# EAGLE design Alarm Controller v3 (EAGLE 7.3.0)
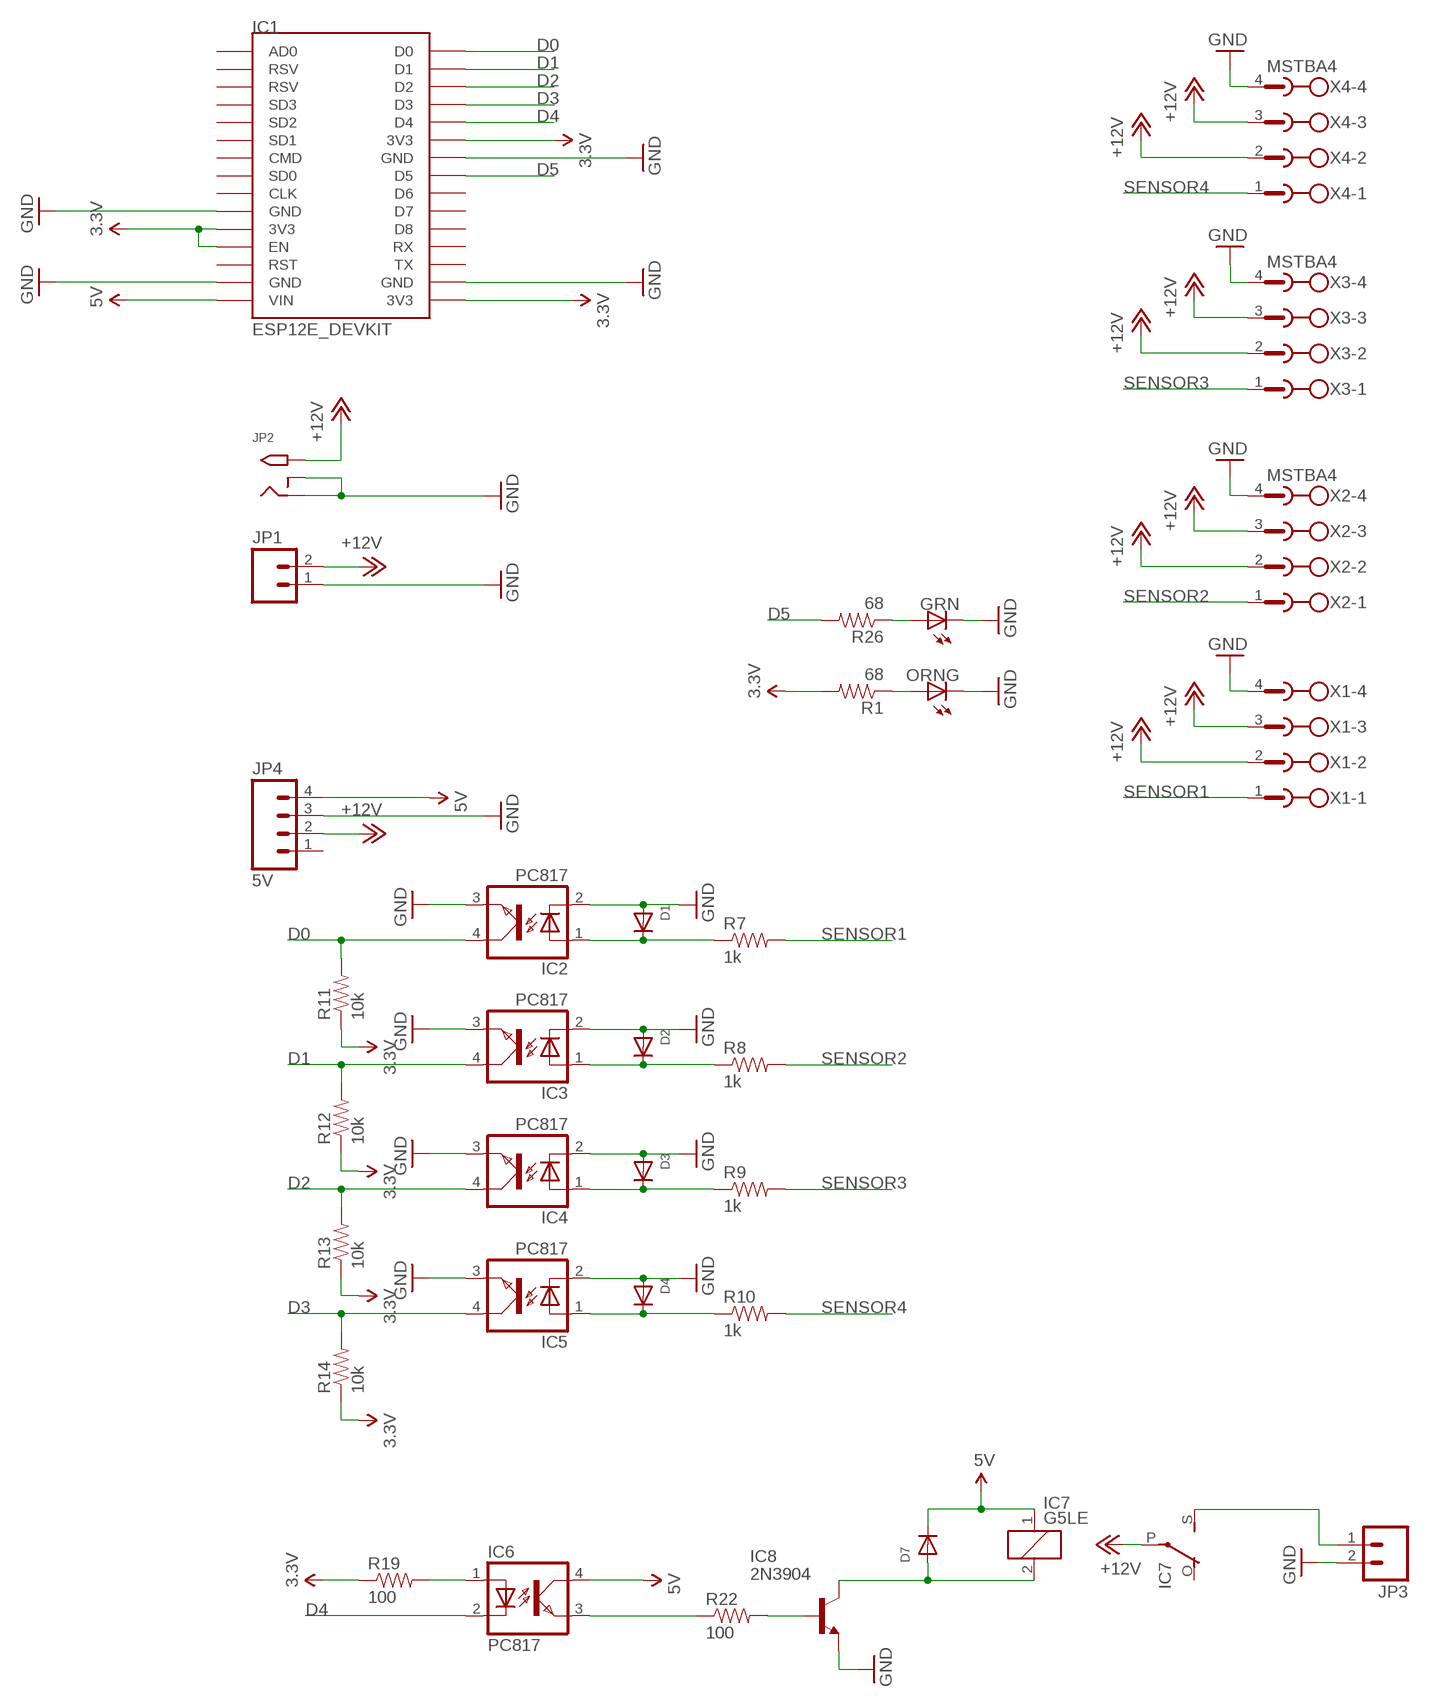
[diagram p0: schematic, sheet 1]

## Parts
D1  RB751S-40TE61CT-ND  DIODESOD-523  [SOD-523]
D2  RB751S-40TE61CT-ND  DIODESOD-523  [SOD-523]
D3  RB751S-40TE61CT-ND  DIODESOD-523  [SOD-523]
D4  RB751S-40TE61CT-ND  DIODESOD-523  [SOD-523]
D7  RB751S-40TE61CT-ND  DIODESOD-523  [SOD-523]
IC1  ESP12E_DEVKIT  [ESP12E_DEVKIT]
IC2  PC817  [DIL04]
IC3  PC817  [DIL04]
IC4  PC817  [DIL04]
IC5  PC817  [DIL04]
IC6  PC817  [DIL04]
IC7  G5LE  [G5LE]
IC8  2N3904  [TO92]
JP1  M023.5MM_LOCK  [SCREWTERMINAL-3.5MM-2_LOCK]
JP2  2.1MMJACKTHM  [PJ-102A]
JP3  M023.5MM_LOCK  [SCREWTERMINAL-3.5MM-2_LOCK]
JP4  5V  M04LOCK_LONGPADS  [1X04_LOCK_LONGPADS]
LED  GRN  LEDSML0805  [SML0805]
LED2  ORNG  LEDSML0805  [SML0805]
R1  68  RESISTOR0603-RES  [0603-RES]
R7  1k  RESISTOR0603-RES  [0603-RES]
R8  1k  RESISTOR0603-RES  [0603-RES]
R9  1k  RESISTOR0603-RES  [0603-RES]
R10  1k  RESISTOR0603-RES  [0603-RES]
R11  10k  RESISTOR0603-RES  [0603-RES]
R12  10k  RESISTOR0603-RES  [0603-RES]
R13  10k  RESISTOR0603-RES  [0603-RES]
R14  10k  RESISTOR0603-RES  [0603-RES]
R19  100  RESISTOR0603-RES  [0603-RES]
R22  100  RESISTOR0603-RES  [0603-RES]
R26  68  RESISTOR0603-RES  [0603-RES]
X1  MSTBA4  [MSTBA4]
X2  MSTBA4  [MSTBA4]
X3  MSTBA4  [MSTBA4]
X4  MSTBA4  [MSTBA4]

## Nets
3.3V: IC1.3V3@0(3V3) IC1.3V3@1(3V3) IC1.3V3@2(3V3) IC1.EN R1.2 R11.1 R12.1 R13.1 R14.1 R19.1
5V: D7.K(C) IC1.VIN IC6.4(COL) IC7.1 JP4.4
+12V: IC7.P(2:P) JP1.2 JP2.TIP JP4.2 X1.2 X1.3 X2.2 X2.3 X3.2 X3.3 X4.2 X4.3
D0: IC1.D0 IC2.4(COL) R11.2
D1: IC1.D1 IC3.4(COL) R12.2
D2: IC1.D2 IC4.4(COL) R13.2
D3: IC1.D3 IC5.4(COL) R14.2
D4: IC1.D4 IC6.2(C)
D5: IC1.D5 R26.2
GND: D1.A D2.A D3.A D4.A IC1.GND@0(GND) IC1.GND@1(GND) IC1.GND@2(GND) IC1.GND@3(GND) IC2.2(C) IC2.3(EMIT) IC3.2(C) IC3.3(EMIT) IC4.2(C) IC4.3(EMIT) IC5.2(C) IC5.3(EMIT) IC8.3(E) JP1.1 JP2.RING JP2.RING_SW JP3.2 JP4.3 LED2.C LED.C X1.4 X2.4 X3.4 X4.4
N$1: LED2.A R1.1
N$2: D7.A IC7.2 IC8.1(C)
N$14: D1.K(C) IC2.1(A) R7.1
N$16: D2.K(C) IC3.1(A) R8.1
N$18: D3.K(C) IC4.1(A) R9.1
N$20: D4.K(C) IC5.1(A) R10.1
N$21: IC6.1(A) R19.2
N$28: IC6.3(EMIT) R22.1
N$29: IC8.2(B) R22.2
N$30: IC7.S(2:S) JP3.1
N$37: LED.A R26.1
SENSOR1: R7.2 X1.1
SENSOR2: R8.2 X2.1
SENSOR3: R9.2 X3.1
SENSOR4: R10.2 X4.1
Unconnected: IC1.AD0 IC1.CLK IC1.CMD IC1.D6 IC1.D7 IC1.D8 IC1.RST IC1.RSV@0(RSV) IC1.RSV@1(RSV) IC1.RX IC1.SD0 IC1.SD1 IC1.SD2 IC1.SD3 IC1.TX IC7.O(2:O) JP4.1

## Library data of the parts
D1-D4 D7 = adafruit:DIODE: Diode SMADIODE - SMA Surface Mount Package 20V 1A Schottky Diode Digikey: 641-1014-6-ND DO-1N4148 - Through Hole Small Current Diode SOD-123 20V 1 A (.5mV Vf) Schottky Diode - Digikey: MBRX120TPMSCT-ND SOD-323 10V 570mA (.38mV Vf, 3ns) Schottky Diode - Digikey: ZLLS410CT-ND SOD-523 30V 30mA Schottky Diode (RB751S-40TE61) - Digikey: RB751S-40TE61CT-ND SOT23-R/W - SOT23 Package (R = Solder Paste/Reflow Ovens, W = Hand-Soldering) BAT54Film 40V 300mA - Digikey: 497-7162-1-ND
IC1 = ESP12E_DEVKIT:ESP12E_DEVKIT: ESP12E DEVKIT BOARD
IC2-IC6 = optocoupler:PC817: SHARP OPTO COUPLER; MPN: PC817X4J000F; OC_FARNELL: 9707727; OC_NEWARK: 97K7059
IC7 = relay:G5LE: RELAY 1 x switch, 10 A/120 V AC, 8 A/30 V DC, Omron; OC_FARNELL: unknown; OC_NEWARK: unknown
IC8 = transistor:2N3904: NPN TRANSISTOR
JP1 JP3 = SparkFun-Connectors:M02: Standard 2-pin 0.1" header. Use with - straight break away headers ( PRT-00116) - right angle break away headers (PRT-00553) - swiss pins (PRT-00743) - machine pins (PRT-00117) - female headers (PRT-00115) Molex polarized connector foot print use with: PRT-08233 with associated crimp pins and housings. 2.54_SCREWTERM for use with PRT-10571. 3.5mm Screw Terminal footprints for PRT-08084 5mm Screw Terminal footprints for use with PRT-08433
JP2 = adafruit:2.1MMJACK: 2.1mm x 5.5mm THM DC jack with internal switch. Digikey part #PJ-102A, 4UCON part #05537 2.1mm x 5.5mm SMT DC jack with internal switch. Digikey part #PJ-002A-SMT, 4UCON part #03267 By microbuilder.eu & adafruit.com
JP4 = SparkFun:M04: Header 4 Standard 4-pin 0.1" header. Use with straight break away headers (SKU : PRT-00116), right angle break away headers (PRT-00553), swiss pins (PRT-00743), machine pins (PRT-00117), and female headers (PRT-00115). Molex polarized connector foot print use with SKU : PRT-08231 with associated crimp pins and housings. 1MM SMD Version SKU: PRT-10208
LED LED2 = led:LED: LED OSRAM: - CHIPLED LG R971, LG N971, LY N971, LG Q971, LY Q971, LO R971, LY R971 LH N974, LH R974 LS Q976, LO Q976, LY Q976 LO Q996 - Hyper CHIPLED LW Q18S LB Q993, LB Q99A, LB R99A - SideLED LS A670, LO A670, LY A670, LG A670, LP A670 LB A673, LV A673, LT A673, LW A673 LH A674 LY A675 LS A676, LA A676, LO A676, LY A676, LW A676 LS A679, LY A679, LG A679 - Hyper Micro SIDELED® LS Y876, LA Y876, LO Y876, LY Y876 LT Y87S - SmartLED LW L88C, LW L88S LB L89C, LB L89S, LG L890 LS L89K, LO L89K, LY L89K LS L896, LA L896, LO L896, LY L896 - TOPLED LS T670, LO T670, LY T670, LG T670, LP T670 LSG T670, LSP T670, LSY T670, LOP T670, LYG T670 LG T671, LOG T671, LSG T671 LB T673, LV T673, LT T673, LW T673 LH T674 LS T676, LA T676, LO T676, LY T676, LB T676, LH T676, LSB T676, LW T676 LB T67C, LV T67C, LT T67C, LS T67K, LO T67K, LY T67K, LW E67C LS E67B, LA E67B, LO E67B, LY E67B, LB E67C, LV E67C, LT E67C LW T67C LS T679, LY T679, LG T679 LS T770, LO T770, LY T770, LG T770, LP T770 LB T773, LV T773, LT T773, LW T773 LH T774 LS E675, LA E675, LY E675, LS T675 LS T776, LA T776, LO T776, LY T776, LB T776 LHGB T686 LT T68C, LB T68C - Hyper Mini TOPLED® LB M676 - Mini TOPLED Santana® LG M470 LS M47K, LO M47K, LY M47K Source: http://www.osram.convergy.de LUXEON: - LUMILED® LXK2-PW12-R00, LXK2-PW12-S00, LXK2-PW14-U00, LXK2-PW14-V00 LXK2-PM12-R00, LXK2-PM12-S00, LXK2-PM14-U00 LXK2-PE12-Q00, LXK2-PE12-R00, LXK2-PE12-S00, LXK2-PE14-T00, LXK2-PE14-U00 LXK2-PB12-K00, LXK2-PB12-L00, LXK2-PB12-M00, LXK2-PB14-N00, LXK2-PB14-P00, LXK2-PB14-Q00 LXK2-PR12-L00, LXK2-PR12-M00, LXK2-PR14-Q00, LXK2-PR14-R00 LXK2-PD12-Q00, LXK2-PD12-R00, LXK2-PD12-S00 LXK2-PH12-R00, LXK2-PH12-S00 LXK2-PL12-P00, LXK2-PL12-Q00, LXK2-PL12-R00 Source: www.luxeon.com KINGBRIGHT: KA-3528ASYC Source: www.kingbright.com
R1 R7-R14 R19 R22 R26 = SparkFun:RESISTOR: Resistor Basic schematic elements and footprints for 0603, 1206, and PTH resistors.
X1-X4 = con-phoenix-508:MSTBA4: PHOENIX; MF: FARNELL; MPN: 1757268; OC_FARNELL: 3705195; OC_NEWARK: 71C4163

## Board
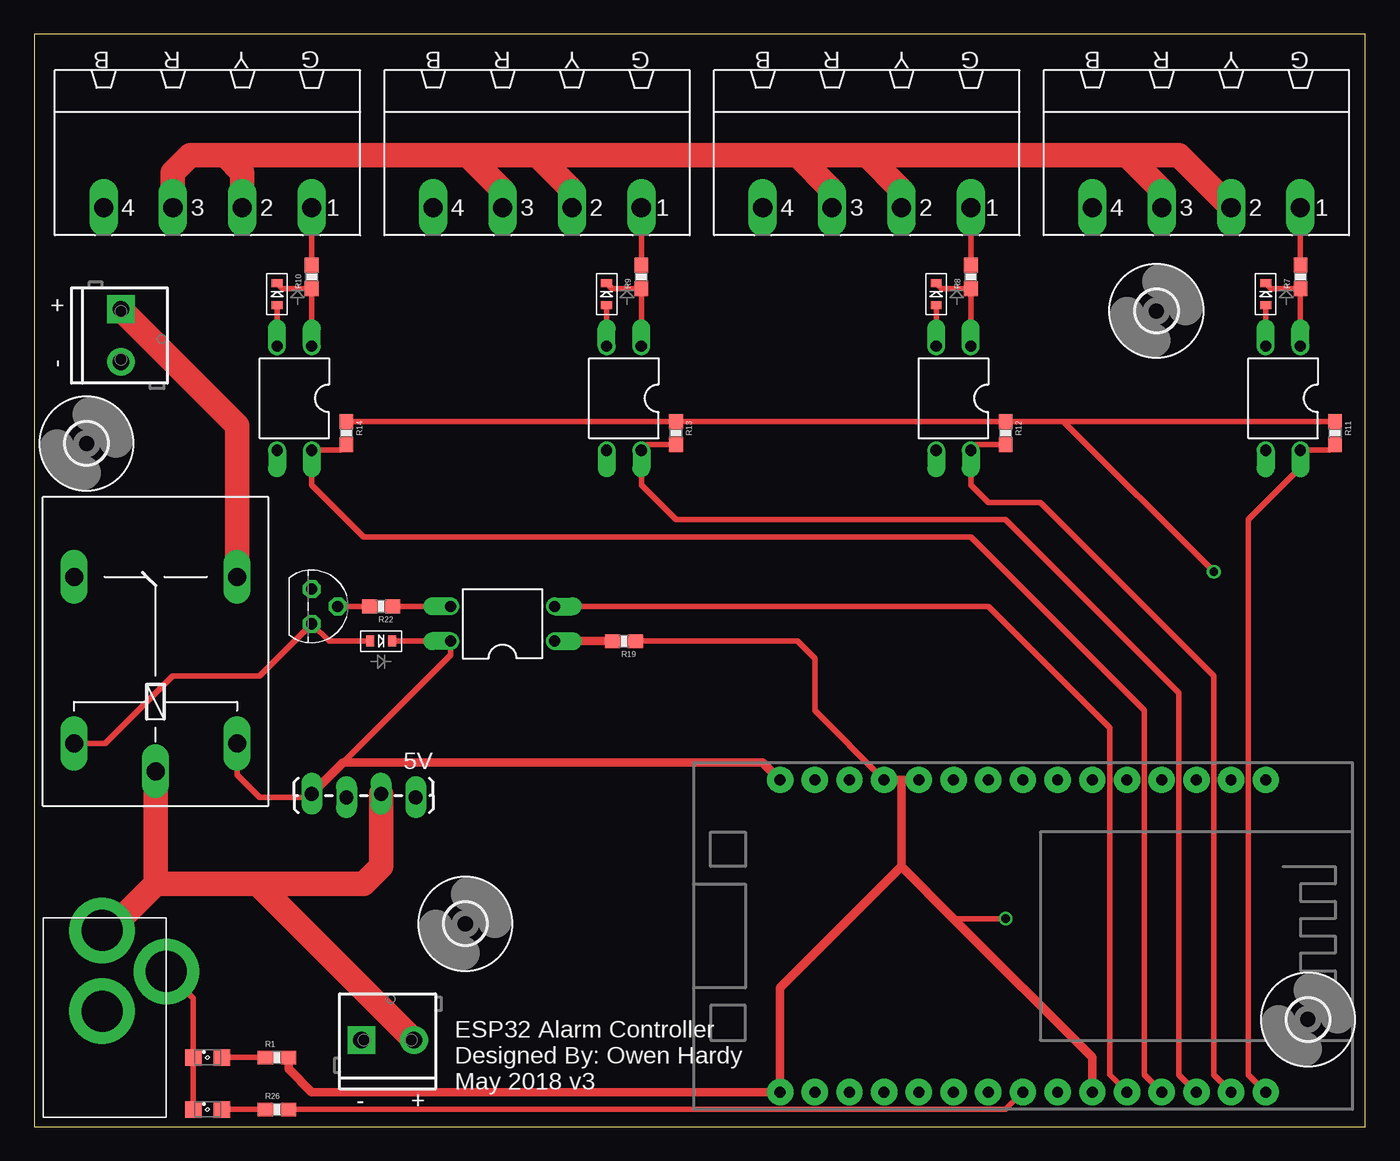
[diagram p1: board, top side]
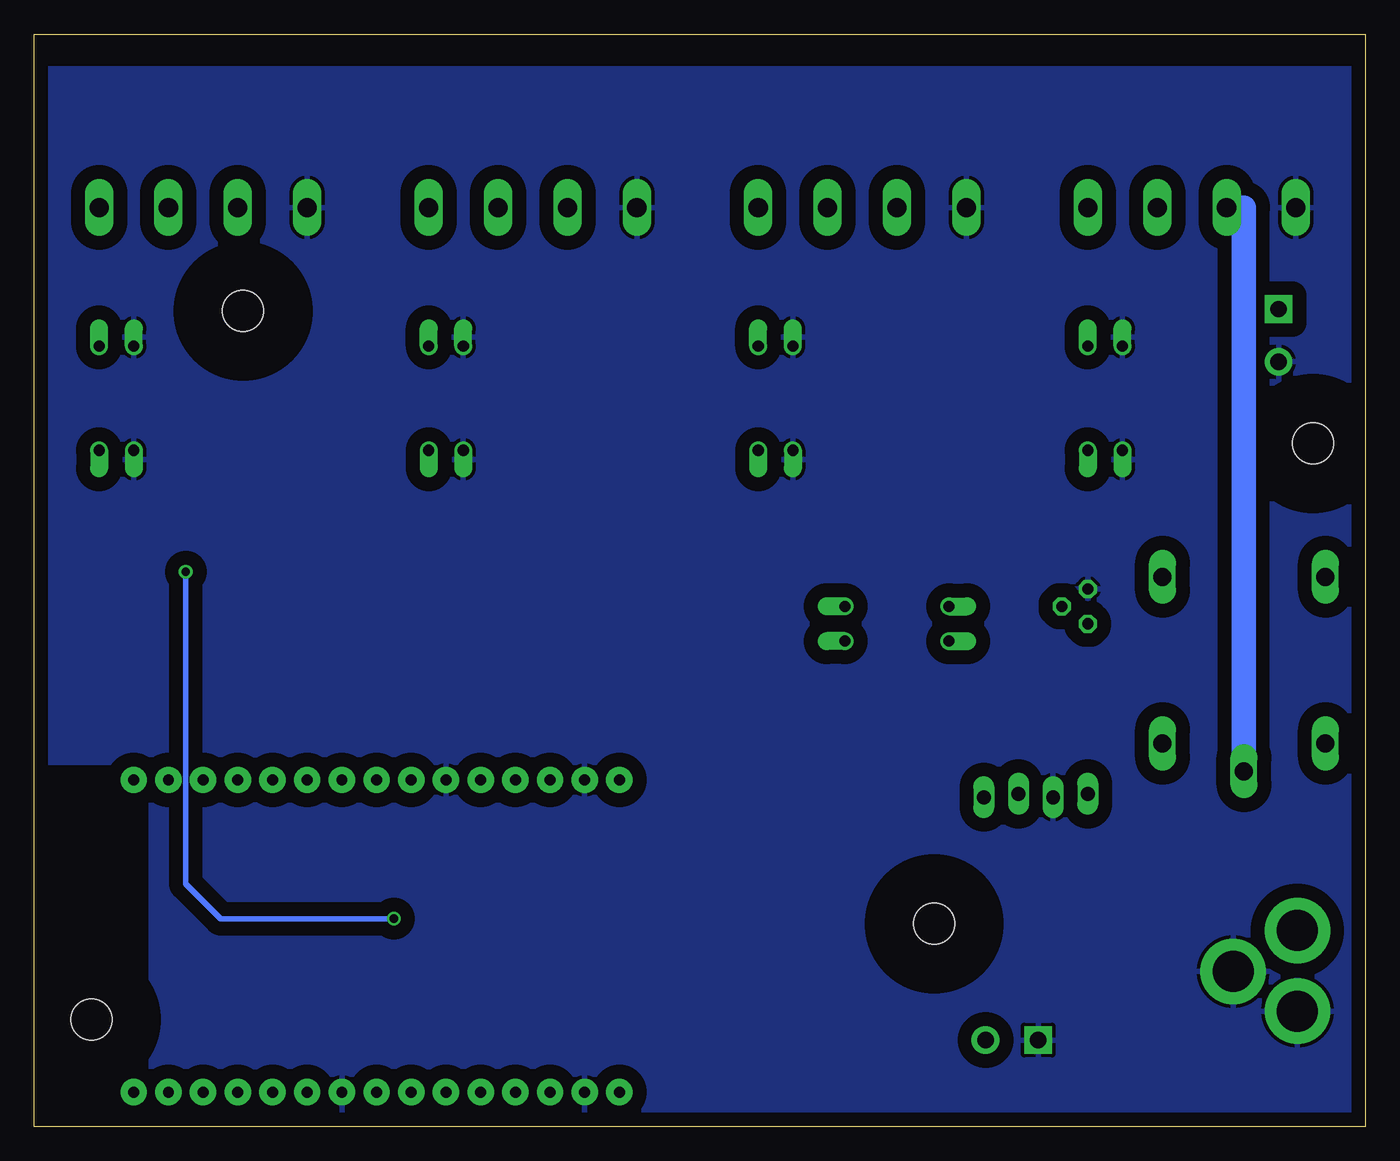
[diagram p2: board, bottom side, seen from below]

Size 97.46 x 80 mm. Coordinates in mm from the lower left corner, seen from the top.
Outline: 0,0 97.46,0 97.46,80 0,80 0,0
Copper layers (1*16): Top 0.035mm / dielectric 1.5mm / Bottom 0.035mm
Design rules "default": minimum track width 10mil, minimum drill 24mil, track to track 8mil, track to pad 8mil, pad to pad 8mil, via to via 8mil, smd to smd 8mil, copper to edge 40mil, drill to drill 8mil, minimum pad ring 10mil, minimum via ring 8mil, stop-mask expansion 4mil, vias tented up to drill 0mil, thermal gap 10mil

### Footprints (pad centres in the part's own frame; a part is rotated, then mirrored left to right if it is on the bottom)
SOD-523 = smd 0.8 x 0.6: A 0,-0.8; K 0,0.8
ESP12E_DEVKIT = drill 0.8 pad 1.93: 3V3@0 -11.43,-7.62; 3V3@1 11.43,5.08; 3V3@2 11.43,-17.78; AD0 -11.43,17.78; CLK -11.43,-2.54; CMD -11.43,2.54; D0 11.43,17.78; D1 11.43,15.24; D2 11.43,12.7; D3 11.43,10.16; D4 11.43,7.62; D5 11.43,0; D6 11.43,-2.54; D7 11.43,-5.08; D8 11.43,-7.62; EN -11.43,-10.16; GND@0 -11.43,-5.08; GND@1 -11.43,-15.24; GND@2 11.43,2.54; GND@3 11.43,-15.24; RST -11.43,-12.7; RSV@0 -11.43,15.24; RSV@1 -11.43,12.7; RX 11.43,-10.16; SD0 -11.43,0; SD1 -11.43,5.08; SD2 -11.43,7.62; SD3 -11.43,10.16; TX 11.43,-12.7; VIN -11.43,-17.78
DIL04 = drill 0.813 offset: 1 -1.27,-3.81; 2 1.27,-3.81; 3 1.27,3.81; 4 -1.27,3.81
G5LE = drill 1.321 long: 1 -7.493,-5.969; 2 -7.493,5.969; O 4.699,5.969; P -9.525,0; S 4.699,-5.969
TO92 = drill 0.813 octagon: 1 1.27,0; 2 0,1.905; 3 -1.27,0
SCREWTERMINAL-3.5MM-2_LOCK = drill 1.2 pad 2.032 square: 1 -0.178,0 | drill 1.2 pad 2.032: 2 3.678,0
PJ-102A = drill 3 pad 4.8: RING 0.1,-3.39; RING_SW -4.6,-6.29; TIP 0.1,-9.29
1X04_LOCK_LONGPADS = drill 1.016 long: 1 0,0; 2 2.54,-0.254; 3 5.08,0; 4 7.62,-0.254
SML0805 = smd 1.2 x 1.2: A 1.05,0; C -1.05,0
0603-RES = smd 1.1 x 1: 1 -0.85,0; 2 0.85,0
3,0 = hole 3: 0,0
MSTBA4 = drill 1.397 long: 1 -7.62,5.08; 2 -2.54,5.08; 3 2.54,5.08; 4 7.62,5.08

### Placement (x,y rotation side)
D1  90.17,60.96 0 top
D2  66.04,60.96 0 top
D3  41.91,60.96 0 top
D4  17.78,60.96 0 top
D7  25.4,35.56 270 top
IC1  72.39,13.97 270 top
IC2  91.44,53.34 180 top
IC3  67.31,53.34 180 top
IC4  43.18,53.34 180 top
IC5  19.05,53.34 180 top
IC6  34.29,36.83 90 top
IC7  8.89,35.56 90 top
IC8  20.32,38.1 270 top
JP1  24.13,6.35 0 top
JP2  5.08,5.08 180 top
JP3  6.35,59.69 270 top
JP4  27.94,24.13 180 top
LED  12.7,1.27 0 top
LED2  12.7,5.08 0 top
R1  17.78,5.08 0 top
R7  92.71,62.23 90 top
R8  68.58,62.23 90 top
R9  44.45,62.23 90 top
R10  20.32,62.23 90 top
R11  95.25,50.8 270 top
R12  71.12,50.8 270 top
R13  46.99,50.8 270 top
R14  22.86,50.8 270 top
R19  43.18,35.56 180 top
R22  25.4,38.1 180 top
R26  17.78,1.27 0 top
U$4  [3,0]  93.26,7.85 0 top
U$5  [3,0]  3.84,50.03 0 top
U$6  [3,0]  82.17,59.73 0 top
U$9  [3,0]  31.57,14.87 0 top
X1  85.09,72.39 180 top
X2  60.96,72.39 180 top
X3  36.83,72.39 180 top
X4  12.7,72.39 180 top

### Tracks (layer width: path | path; a pad name or v marks a point on that pad's centre or on a via)
3.3V  (via drill 0.6)
  Top 0.406: R11.1 75.35,51.65 | 75.35,51.65 R12.1 R13.1 R14.1 | R19.1 55.88,35.56 57.15,34.29 57.15,30.48 IC1.EN | 67.31,15.24 v71.12,15.24 | v86.36,40.64 75.35,51.65
  Top 0.61: IC1.3V3@0 63.5,25.4 | 63.5,25.4 IC1.EN | 63.5,19.05 54.61,10.16 IC1.3V3@2 20.32,2.54 18.63,4.23 R1.2 | 63.5,19.05 63.5,25.4 | IC1.3V3@1 77.47,5.08 67.31,15.24 63.5,19.05
  Bottom 0.406: v71.12,15.24 83.82,15.24 86.36,17.78 v86.36,40.64
5V
  Top 0.406: D7.K IC6.4 30.48,34.54 22.61,26.67 | JP4.4 20.07,24.13 16.51,24.13 14.86,25.78 IC7.1
  Top 0.61: JP4.4 22.61,26.67 53.34,26.67 IC1.VIN
+12V
  Top 1.778: X4.3 10.16,69.85 11.43,71.12 13.97,71.12 | 13.97,71.12 31.75,71.12 | 31.75,71.12 36.83,71.12 | 36.83,71.12 55.88,71.12 | 55.88,71.12 60.96,71.12 | 60.96,71.12 80.01,71.12 | 80.01,71.12 83.82,71.12 X1.2 | X1.3 82.55,68.58 80.01,71.12 | X2.2 63.5,68.58 60.96,71.12 | X2.3 58.42,68.58 55.88,71.12 | X3.2 39.37,68.58 36.83,71.12 | X3.3 34.29,68.58 31.75,71.12 | X4.2 15.24,69.85 13.97,71.12 | IC7.P 8.89,17.78 | 8.89,17.78 5.08,13.97 5.08,14.27 JP2.TIP | 8.89,17.78 16.38,17.78 | 16.38,17.78 JP1.2 | 16.38,17.78 24.13,17.78 25.4,19.05 JP4.2
  Bottom 1.778: IC7.P 8.89,67.31 X4.3
D0
  Top 0.406: R11.2 94.83,49.53 IC2.4 92.71,48.26 88.9,44.45 88.9,3.81 IC1.D0
D1
  Top 0.406: IC1.D1 86.36,3.81 86.36,33.02 73.66,45.72 69.85,45.72 68.58,46.99 IC3.4 69,49.95 R12.2
D2
  Top 0.406: R13.2 44.87,49.95 IC4.4 44.45,46.99 46.99,44.45 71.12,44.45 83.82,31.75 83.82,3.81 IC1.D2
D3
  Top 0.406: R14.2 22.44,49.53 IC5.4 20.32,46.99 24.13,43.18 68.58,43.18 81.28,30.48 81.28,3.81 IC1.D3
D4
  Top 0.406: IC1.D4 78.74,3.81 78.74,29.21 69.85,38.1 IC6.2
D5
  Top 0.406: R26.2 71.12,1.27 IC1.D5
GND
  Top 0.406: LED.C LED2.C 11.65,9.4 JP2.RING_SW | IC5.2 D4.A | D3.A IC4.2 | D2.A IC3.2 | D1.A IC2.2
  Bottom 0.406: 22.86,25.4 JP4.3
  pour Bottom (isolate 1.016): 0,0 88.9,0 88.9,3.81 88.9,26.67 97.79,26.67 97.79,77.47 0,77.47 0,76.2
N$1
  Top 0.406: LED2.A R1.1
N$2
  Top 0.406: D7.A 21.59,35.56 IC8.1 16.51,33.02 10.16,33.02 5.21,28.07 IC7.2
N$14
  Top 0.406: IC2.1 R7.1 90.55,61.38 D1.K
N$16
  Top 0.406: D2.K 66.42,61.38 R8.1 IC3.1
N$18
  Top 0.406: D3.K 42.29,61.38 R9.1 IC4.1
N$20
  Top 0.406: D4.K 18.16,61.38 R10.1 IC5.1
N$21
  Top 0.61: R19.2 IC6.1
N$28
  Top 0.406: IC6.3 R22.1
N$29
  Top 0.406: R22.2 IC8.2
N$30
  Top 1.778: IC7.S 14.86,51.36 JP3.1
N$37
  Top 0.406: LED.A R26.1
SENSOR1
  Top 0.406: X1.1 R7.2
SENSOR2
  Top 0.406: R8.2 X2.1
SENSOR3
  Top 0.406: X3.1 R9.2
SENSOR4
  Top 0.406: X4.1 R10.2

### Text on the board
tNames: B | R | Y | G | B | R | Y | G | B | R | Y | G | B | R | Y | G | + | - | ESP32 Alarm Controller / Designed By: Owen Hardy / May 2018 v3 | - | +